# Altium schematic sheet top.SchDoc: FMC Connector Top
size A; Author: Zac Carico; CompanyName: BYUI; DrawnBy: Zac Carico; Engineer: Zac Carico; Organization: CSEE; DocumentNumber: 4; Revision: 0.0.1; SheetNumber: 4; SheetTotal: 15
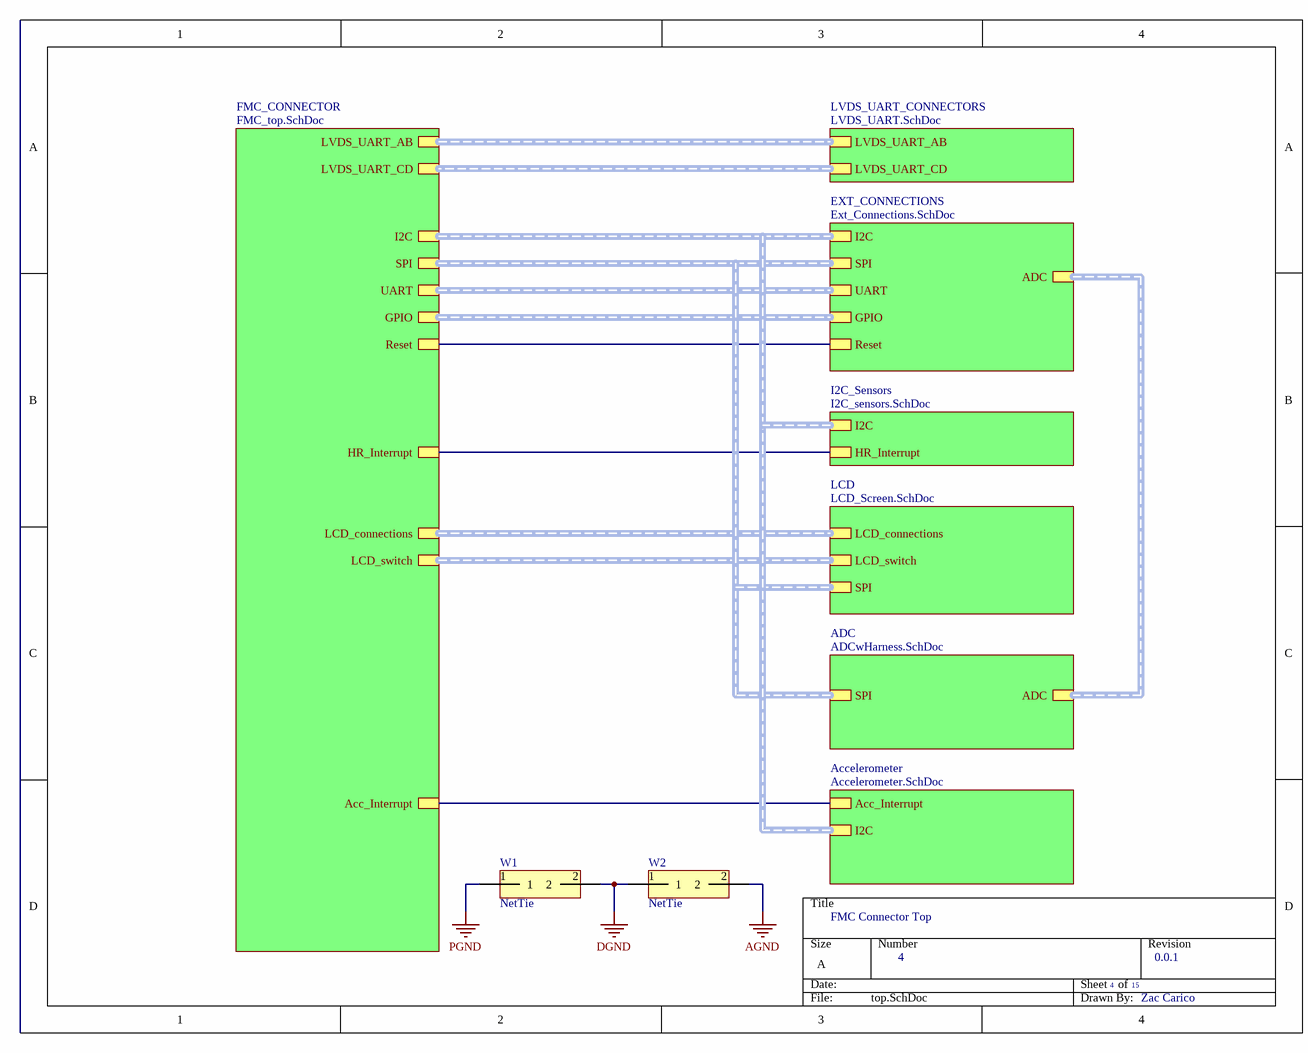
[diagram p0: top.SchDoc]

## Parts
W1  NetTie  [NetTie]  (net tie, no BOM)
W2  NetTie  [NetTie]  (net tie, no BOM)

## Sub-sheets
Accelerometer = Accelerometer.SchDoc: Acc_Interrupt, I2C (harness I2C)
ADC = ADCwHarness.SchDoc: ADC (harness ADC), SPI (harness SPI)
EXT_CONNECTIONS = Ext_Connections.SchDoc: I2C (harness I2C), SPI (harness SPI), UART (harness UART), GPIO (harness GPIO), ADC (harness ADC), Reset
FMC_CONNECTOR = FMC_top.SchDoc: GPIO (harness GPIO), UART (harness UART), I2C (harness I2C), SPI (harness SPI), LCD_connections (harness LCD_connections), LCD_switch (harness LCD_switch), Acc_Interrupt, LVDS_UART_AB (harness LVDS_UART_AB), LVDS_UART_CD (harness LVDS_UART_CD), Reset, HR_Interrupt
I2C_Sensors = I2C_sensors.SchDoc: I2C (harness I2C), HR_Interrupt
LCD = LCD_Screen.SchDoc: LCD_connections (harness LCD_connections), LCD_switch (harness LCD_switch), SPI (harness SPI)
LVDS_UART_CONNECTORS = LVDS_UART.SchDoc: LVDS_UART_CD (harness LVDS_UART_CD), LVDS_UART_AB (harness LVDS_UART_AB)

## Nets
AGND: W2.2
DGND: W1.2 W2.1
PGND: W1.1
(unnamed): sheet FMC_CONNECTOR/Acc_Interrupt, sheet Accelerometer/Acc_Interrupt
(unnamed): sheet FMC_CONNECTOR/Reset, sheet EXT_CONNECTIONS/Reset
(unnamed): sheet FMC_CONNECTOR/HR_Interrupt, sheet I2C_Sensors/HR_Interrupt

## Buses and harness runs
harness sheet Accelerometer/I2C = sheet EXT_CONNECTIONS/I2C = sheet FMC_CONNECTOR/I2C = sheet I2C_Sensors/I2C
harness sheet ADC/ADC = sheet EXT_CONNECTIONS/ADC
harness sheet ADC/SPI = sheet EXT_CONNECTIONS/SPI = sheet FMC_CONNECTOR/LCD_switch = sheet FMC_CONNECTOR/SPI = sheet LCD/LCD_switch = sheet LCD/SPI
harness sheet EXT_CONNECTIONS/GPIO = sheet FMC_CONNECTOR/GPIO
harness sheet EXT_CONNECTIONS/UART = sheet FMC_CONNECTOR/UART
harness sheet FMC_CONNECTOR/LCD_connections = sheet LCD/LCD_connections
harness sheet FMC_CONNECTOR/LVDS_UART_AB = sheet LVDS_UART_CONNECTORS/LVDS_UART_AB
harness sheet FMC_CONNECTOR/LVDS_UART_CD = sheet LVDS_UART_CONNECTORS/LVDS_UART_CD